# EAGLE design gps (EAGLE 9.0.0)
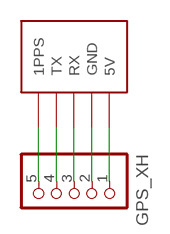
[diagram p0: schematic, sheet 1]

## Parts
GPS  GPS  [GPS]
GPS_XH  B5B-XH-A  [B5B-XH-A]

## Nets
N$1: GPS.1PPS GPS_XH.5
N$2: GPS.TX GPS_XH.4
N$3: GPS.RX GPS_XH.3
N$4: GPS.GND GPS_XH.2
N$5: GPS.5V GPS_XH.1

## Library data of the parts
GPS = michibiki_gps:GPS
GPS_XH = jst-xh:B5B-XH-A: Wire-to-Board 2.5mm pitch top mount connector Source: http://www.jst-mfg.com/product/pdf/jpn/XH.pdf http://www.jst-mfg.com/product/detail.php?series=277

## Board
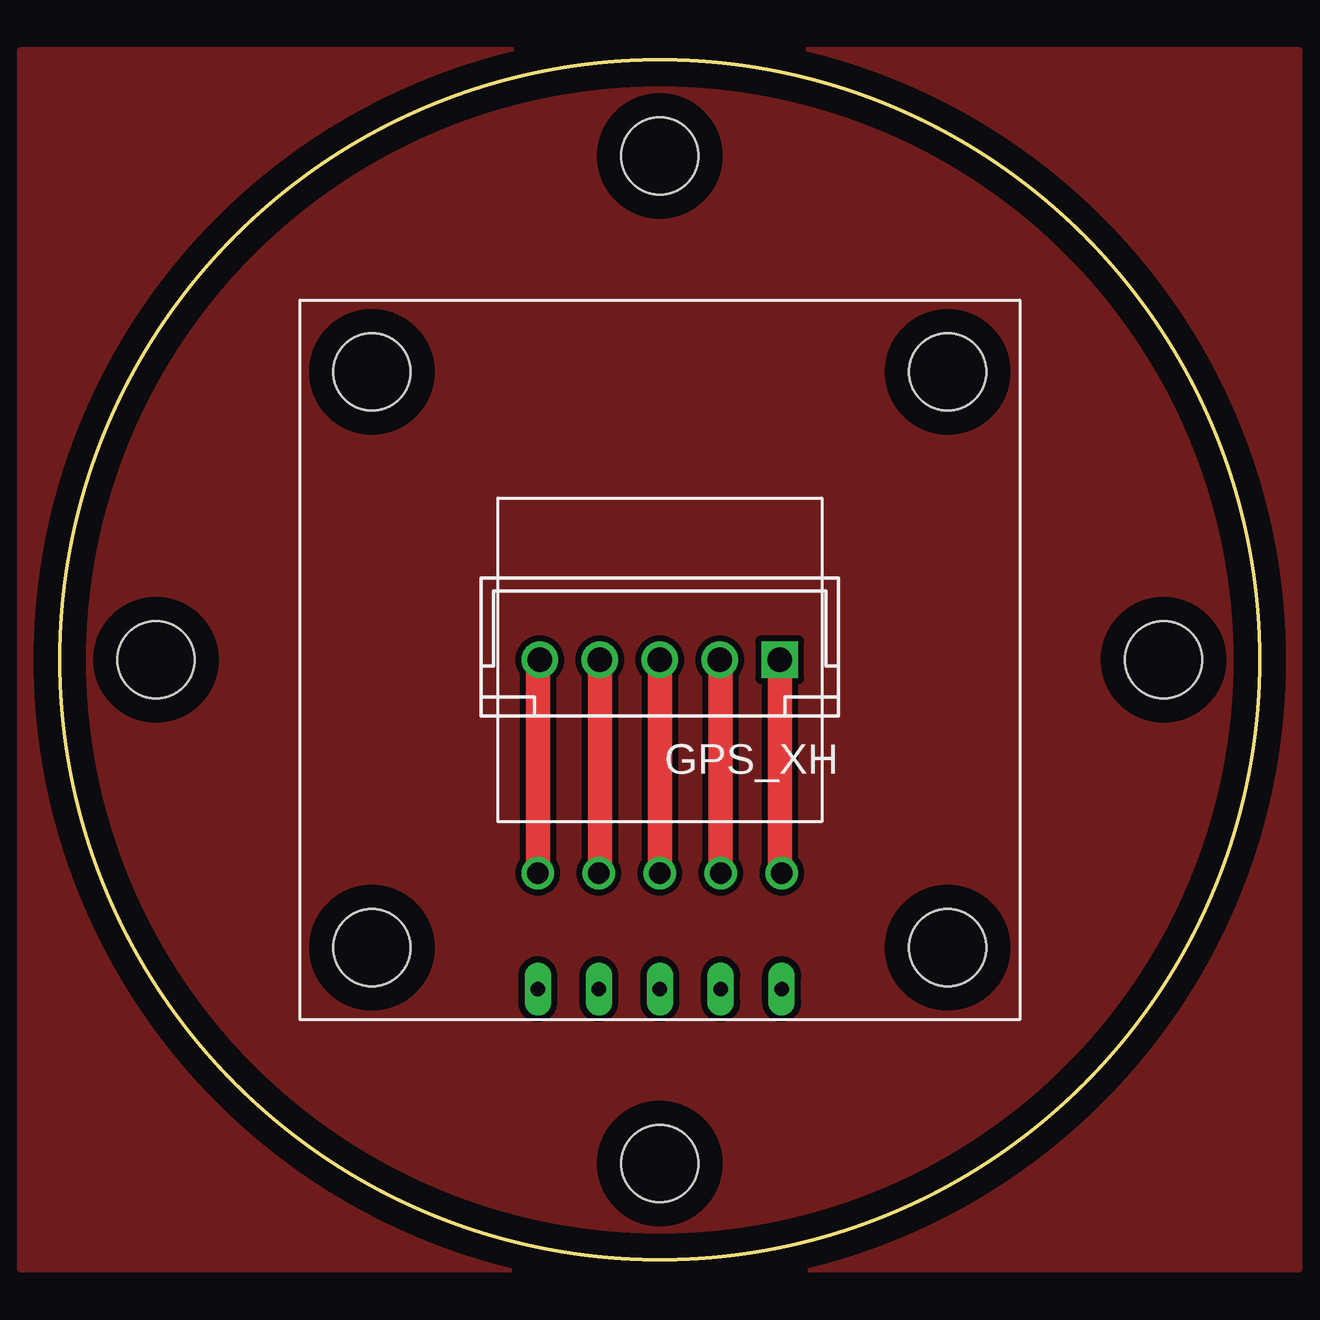
[diagram p1: board, top side]
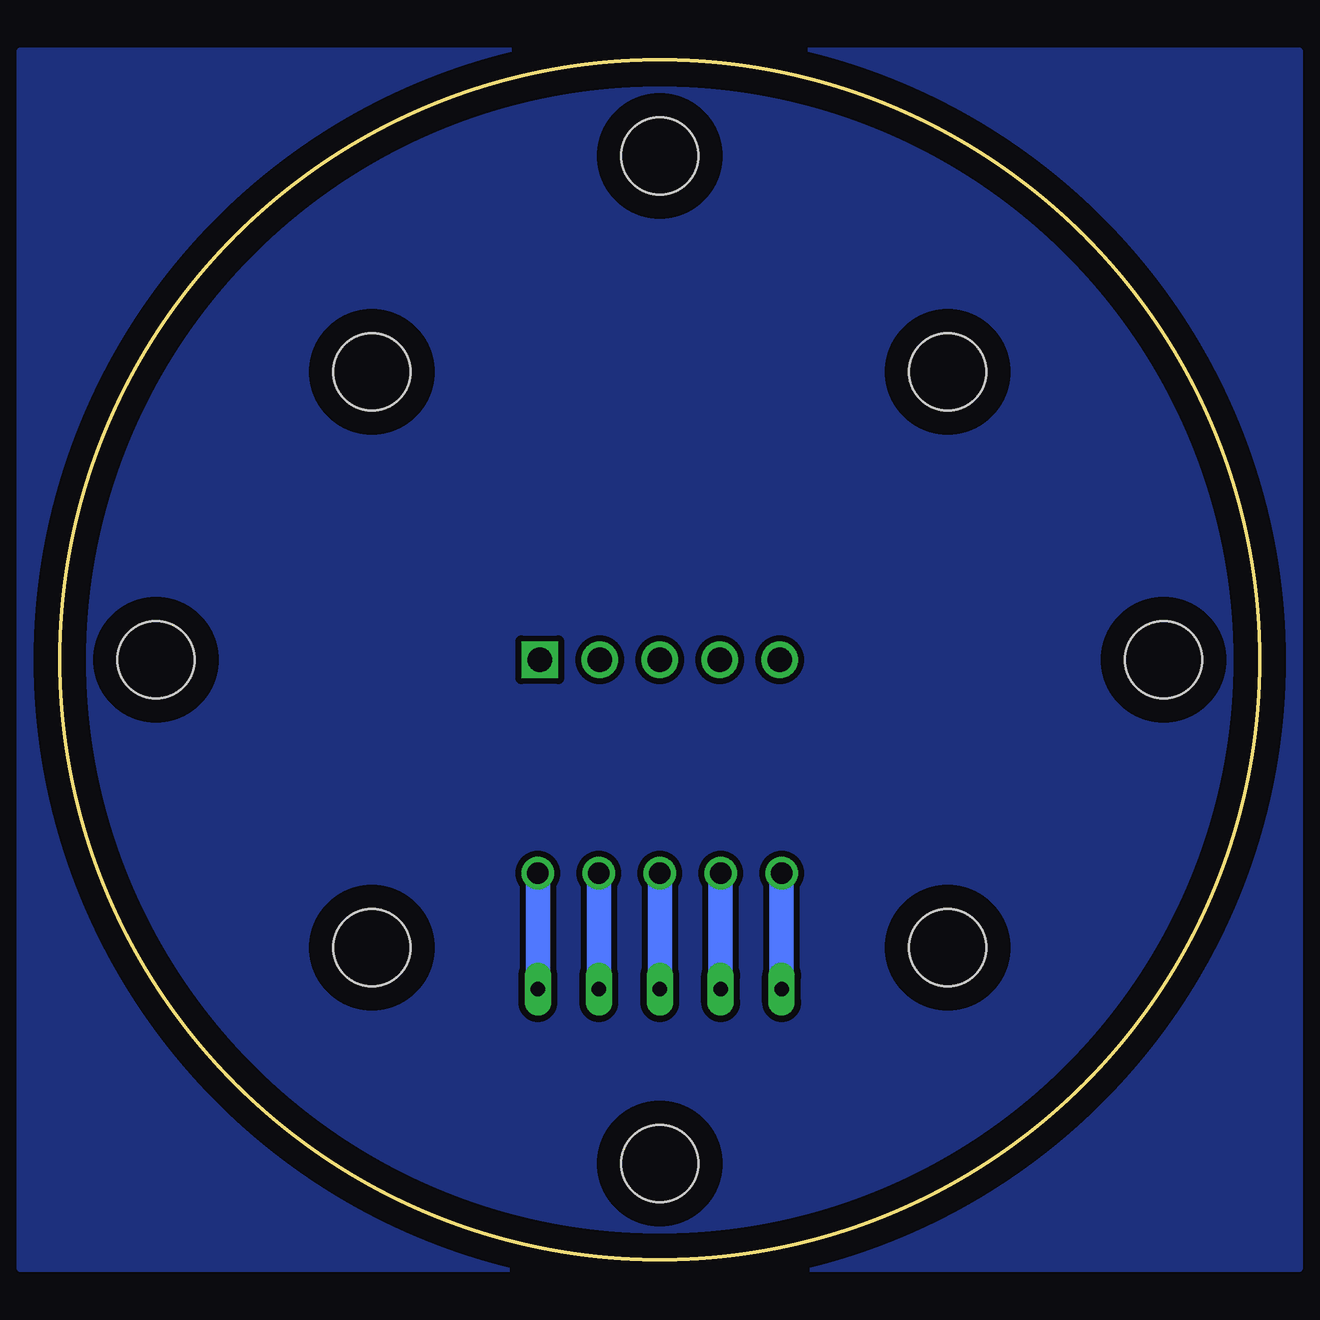
[diagram p2: board, bottom side, seen from below]

Size 50 x 50 mm. Coordinates in mm from the lower left corner, seen from the top.
Outline: circle at 25,25 radius 25
Copper layers (1*16): Top 0.035mm / dielectric 1.5mm / Bottom 0.035mm
Design rules "default": minimum track width 6mil, minimum drill 0.35mm, track to track 6mil, track to pad 6mil, pad to pad 6mil, via to via 6mil, smd to smd 6mil, copper to edge 40mil, drill to drill 6mil, minimum pad ring 10mil, minimum via ring 8mil, stop-mask expansion 4mil, vias tented up to drill 0mil, thermal gap 10mil
Holes 3.2 mm at 25,46 4,25 25,4 46,25

### Footprints (pad centres in the part's own frame; a part is rotated, then mirrored left to right if it is on the bottom)
GPS = drill 0.6 long: 1PPS -5.08,-13.73; 5V 5.08,-13.73; GND 2.54,-13.73; RX 0,-13.73; TX -2.54,-13.73 | hole 3.2: -12,-12; 12,-12; 12,12; -12,12
B5B-XH-A = drill 1.016 square: 1 -5,0 | drill 1.016: 2 -2.5,0; 3 0,0; 4 2.5,0; 5 5,0

### Placement (x,y rotation side)
GPS  25,25 0 top
GPS_XH  25,25 180 top

### Tracks (layer width: path | path; a pad name or v marks a point on that pad's centre or on a via)
GND
  pour Top (isolate 0.254): -1.67,25 -1.67,-0.4 51.67,-0.4 51.67,50.4 2.14,50.4 -1.67,50.4
  pour Bottom (isolate 0.254): -1.67,36.43 -1.67,-0.4 49.13,-0.4 51.67,-0.4 51.67,45.32 51.67,50.4 4.68,50.4 -1.67,50.4
N$1  (via drill 0.9)
  Top 1.016: GPS_XH.5 19.92,24.92 v19.92,16.11
  Bottom 1.016: v19.92,16.11 GPS.1PPS
N$2  (via drill 0.9)
  Top 1.016: v22.46,16.11 22.5,16.15 GPS_XH.4
  Bottom 1.016: GPS.TX v22.46,16.11
N$3  (via drill 0.9)
  Top 1.016: GPS_XH.3 v25,16.11
  Bottom 1.016: v25,16.11 GPS.RX
N$4  (via drill 0.9)
  Top 1.016: v27.54,16.11 27.54,24.96 GPS_XH.2
  Bottom 1.016: GPS.GND v27.54,16.11
N$5  (via drill 0.9)
  Top 1.016: GPS_XH.1 30,16.19 v30.08,16.11
  Bottom 1.016: v30.08,16.11 GPS.5V